# Altium schematic sheet B505_Clk_syn.SchDoc
size A3
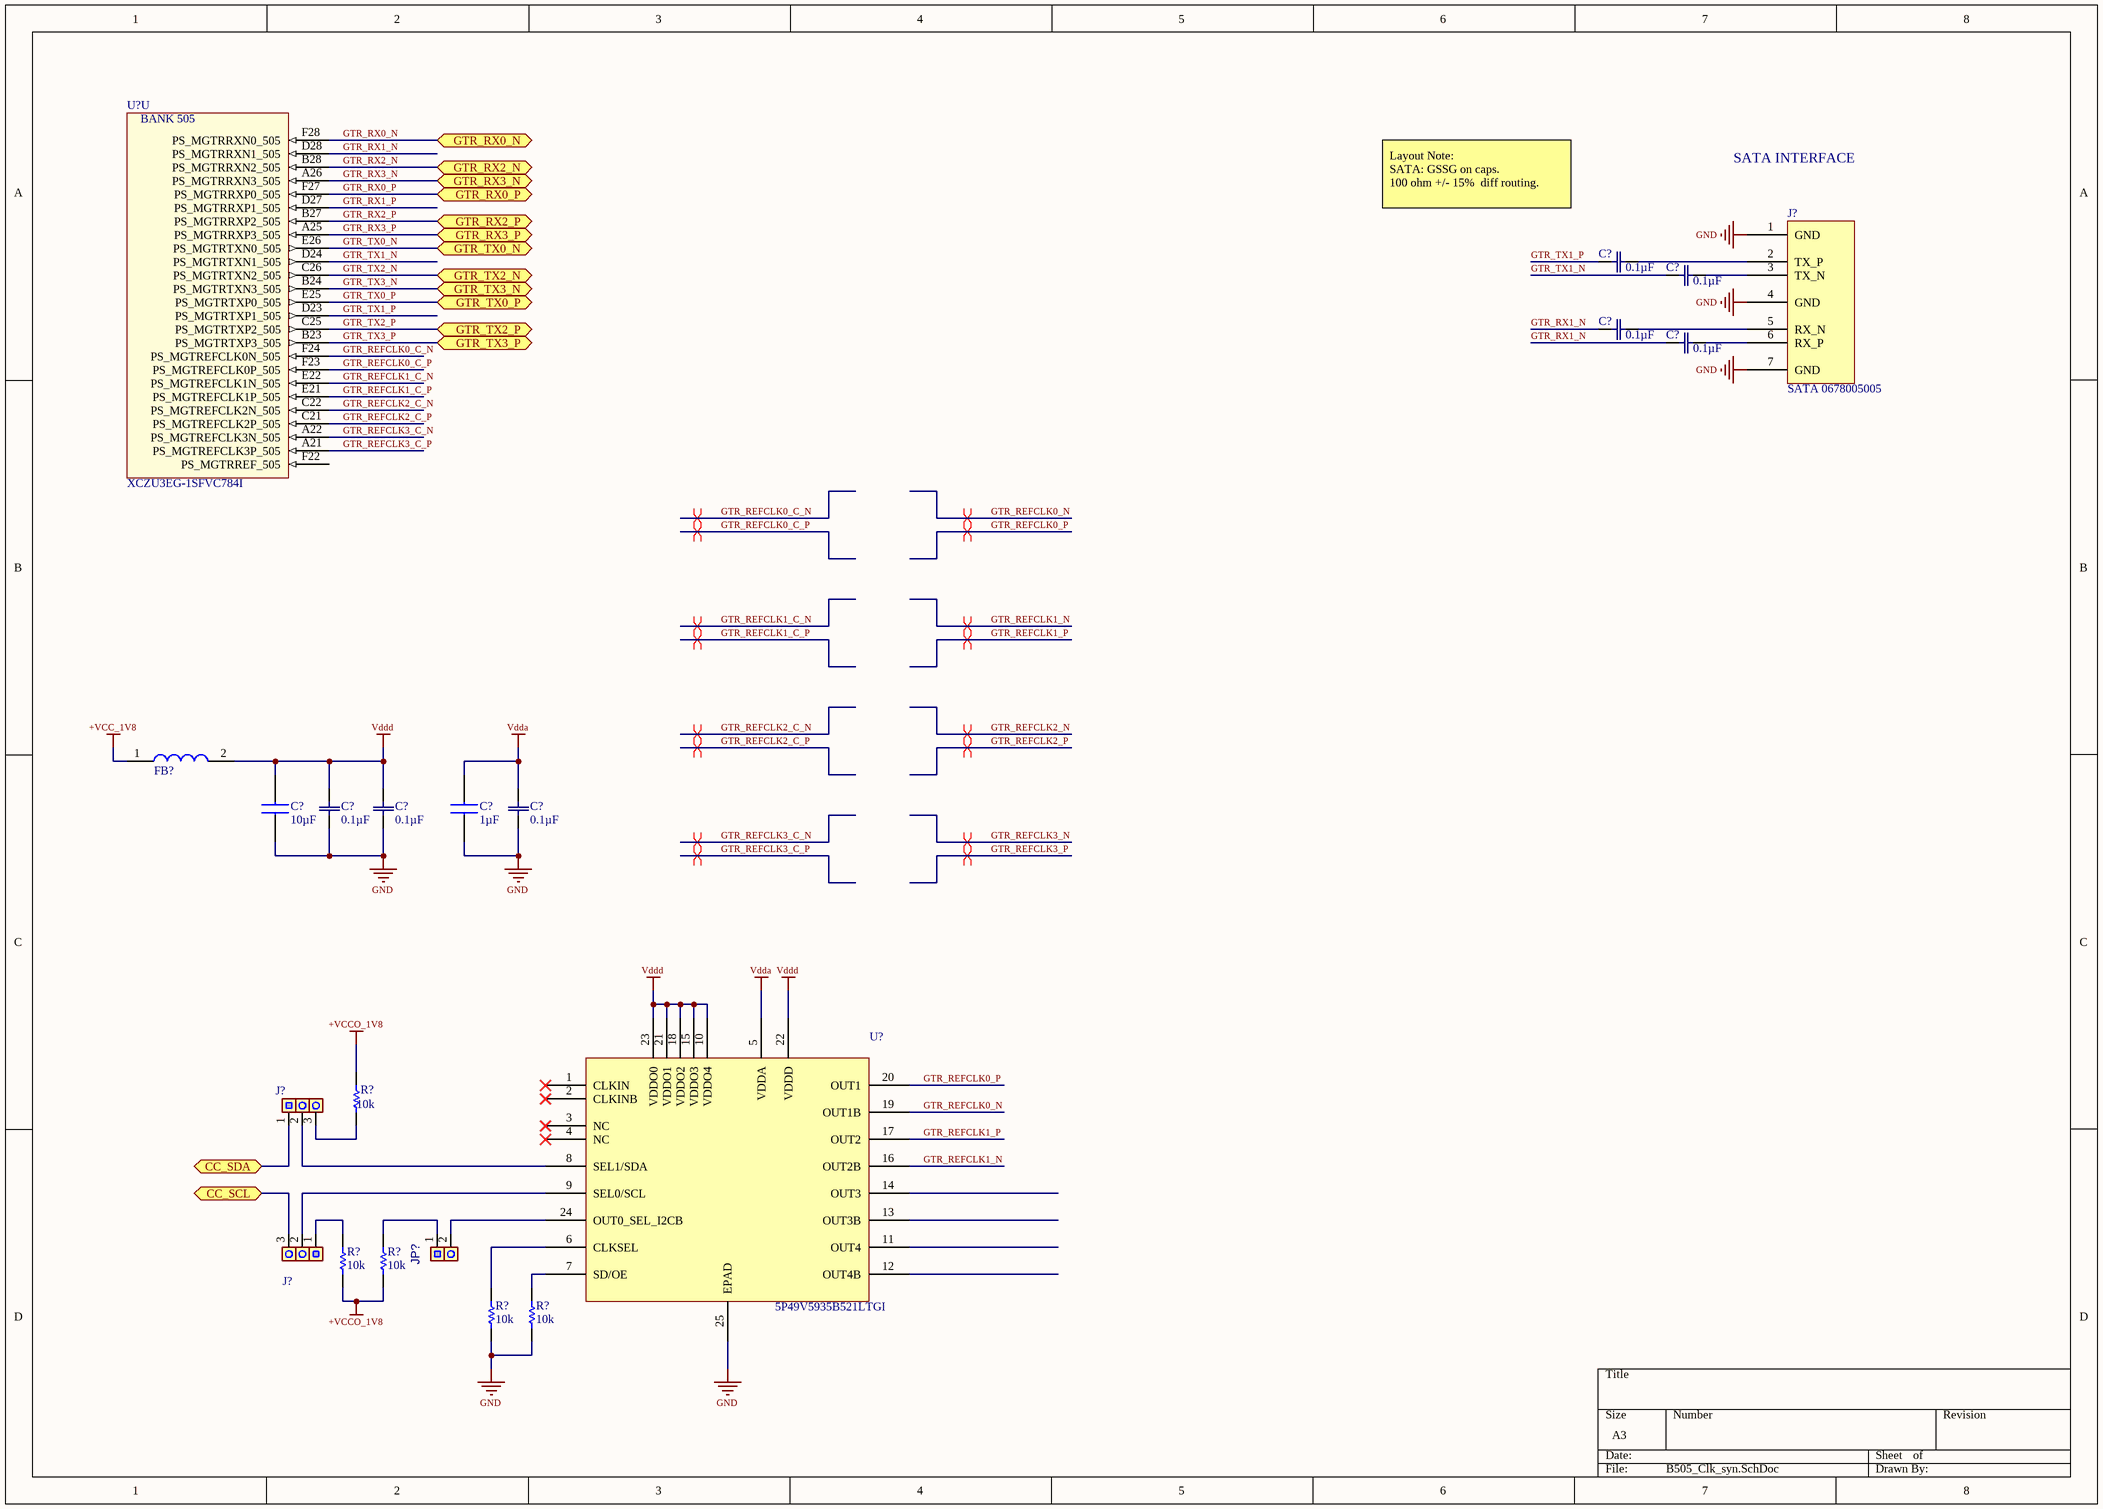
[diagram p0: B505_Clk_syn.SchDoc]

## Parts
(Parts that share a designator on the sheet are numbered #1, #2 ... from top to bottom, then left to right.)
C?#1  0.1µF  [CAP_0603]
C?#2  0.1µF  [CAP_0603]
C?#3  0.1µF  [CAP_0603]
C?#4  0.1µF  [CAP_0603]
C?#5  value 0.1µF  [CAP_0603]  (hidden comment: C0603X5R1E104K030BB)
C?#6  value 0.1µF  [CAP_0603]  (hidden comment: C0603X5R1E104K030BB)
C?#7  value 0.1µF  [CAP_0603]  (hidden comment: C0603X5R1E104K030BB)
C?#8  value 10µF  [CAP 0805]  (hidden comment: CAP 0805C106K4PACTU)
C?#9  value 1µF  [C0805C105]  (hidden comment: CAP 0805C105K5RACTU)
FB?  BLM15AG601SN1D  [BEADC1005X55N]  (value not drawn)
J?#1  SATA 0678005005  [SATA HEADER]
J?#2  5-146280-3  [CONN_5-146280-3]  (value not drawn)
J?#3  5-146280-3  [CONN_5-146280-3]  (value not drawn)
JP?  HDR-2.54 Male 1x2  [HDR_M_2.54_1x2]  (value not drawn)
R?#1  value 10k  [RESC1005L_0402]  (hidden comment: RES0402_10K_0W1_05T)
R?#2  value 10k  [RESC1005L_0402]  (hidden comment: RES0402_10K_0W1_05T)
R?#3  value 10k  [RESC1005L_0402]  (hidden comment: RES0402_10K_0W1_05T)
R?#4  value 10k  [RESC1005L_0402]  (hidden comment: RES0402_10K_0W1_05T)
R?#5  value 10k  [RESC1005L_0402]  (hidden comment: RES0402_10K_0W1_05T)
U?#1  XCZU3EG-1SFVC784I  [BGA784x28]  (part U of 22)
U?#2  5P49V5935B521LTGI

## Ports
CC_SCL, CC_SDA, GTR_RX0_N, GTR_RX0_P, GTR_RX2_N, GTR_RX2_P, GTR_RX3_N, GTR_RX3_P, GTR_TX0_N, GTR_TX0_P, GTR_TX2_N, GTR_TX2_P, GTR_TX3_N, GTR_TX3_P

## Nets
+VCC_1V8: FB?.1
+VCCO_1V8: R?#1.2 R?#2.1 R?#3.1
GND: C?#5.1 C?#6.1 C?#7.1 C?#8.1 C?#9.1 J?#1.1(GND) J?#1.4(GND) J?#1.7(GND) R?#4.1 R?#5.1 U?#2.25(EPAD)
Vdda: C?#7.2 C?#9.2 U?#2.5(VDDA)
Vddd: C?#5.2 C?#6.2 C?#8.2 FB?.2 U?#2.10(VDDO4) U?#2.15(VDDO3) U?#2.18(VDDO2) U?#2.21(VDDO1) U?#2.22(VDDD) U?#2.23(VDDO0)
CC_SCL: J?#3.3(P3) ; port CC_SCL
CC_SDA: J?#2.1(P1) ; port CC_SDA
GTR_REFCLK0_C_N: U?#1.F24(PS_MGTREFCLK0N_505)
GTR_REFCLK0_C_P: U?#1.F23(PS_MGTREFCLK0P_505)
GTR_REFCLK0_N: U?#2.19(OUT1B)
GTR_REFCLK0_P: U?#2.20(OUT1)
GTR_REFCLK1_C_N: U?#1.E22(PS_MGTREFCLK1N_505)
GTR_REFCLK1_C_P: U?#1.E21(PS_MGTREFCLK1P_505)
GTR_REFCLK1_N: U?#2.16(OUT2B)
GTR_REFCLK1_P: U?#2.17(OUT2)
GTR_REFCLK2_C_N: U?#1.C22(PS_MGTREFCLK2N_505)
GTR_REFCLK2_C_P: U?#1.C21(PS_MGTREFCLK2P_505)
GTR_REFCLK3_C_N: U?#1.A22(PS_MGTREFCLK3N_505)
GTR_REFCLK3_C_P: U?#1.A21(PS_MGTREFCLK3P_505)
GTR_RX0_N: U?#1.F28(PS_MGTRRXN0_505) ; port GTR_RX0_N
GTR_RX0_P: U?#1.F27(PS_MGTRRXP0_505) ; port GTR_RX0_P
GTR_RX1_N: C?#3.2 C?#4.2 U?#1.D28(PS_MGTRRXN1_505)
GTR_RX1_P: U?#1.D27(PS_MGTRRXP1_505)
GTR_RX2_N: U?#1.B28(PS_MGTRRXN2_505) ; port GTR_RX2_N
GTR_RX2_P: U?#1.B27(PS_MGTRRXP2_505) ; port GTR_RX2_P
GTR_RX3_N: U?#1.A26(PS_MGTRRXN3_505) ; port GTR_RX3_N
GTR_RX3_P: U?#1.A25(PS_MGTRRXP3_505) ; port GTR_RX3_P
GTR_TX0_N: U?#1.E26(PS_MGTRTXN0_505) ; port GTR_TX0_N
GTR_TX0_P: U?#1.E25(PS_MGTRTXP0_505) ; port GTR_TX0_P
GTR_TX1_N: C?#2.2 U?#1.D24(PS_MGTRTXN1_505)
GTR_TX1_P: C?#1.2 U?#1.D23(PS_MGTRTXP1_505)
GTR_TX2_N: U?#1.C26(PS_MGTRTXN2_505) ; port GTR_TX2_N
GTR_TX2_P: U?#1.C25(PS_MGTRTXP2_505) ; port GTR_TX2_P
GTR_TX3_N: U?#1.B24(PS_MGTRTXN3_505) ; port GTR_TX3_N
GTR_TX3_P: U?#1.B23(PS_MGTRTXP3_505) ; port GTR_TX3_P
NetC?#1_1: C?#1.1 J?#1.2(TX_P)
NetC?#2_1: C?#2.1 J?#1.3(TX_N)
NetC?#3_1: C?#3.1 J?#1.5(RX_N)
NetC?#4_1: C?#4.1 J?#1.6(RX_P)
NetJ?#2_2: J?#2.2(P2) U?#2.8(SEL1/SDA)
NetJ?#2_3: J?#2.3(P3) R?#1.1
NetJ?#3_1: J?#3.1(P1) R?#2.2
NetJ?#3_2: J?#3.2(P2) U?#2.9(SEL0/SCL)
NetJP?_1: JP?.1(P1) R?#3.2
NetJP?_2: JP?.2(P2) U?#2.24(OUT0_SEL_I2CB)
NetR?#4_2: R?#4.2 U?#2.6(CLKSEL)
NetR?#5_2: R?#5.2 U?#2.7(SD/OE)

Not connected (* = marked no-connect by the designer): U?#1 F22(PS_MGTRREF_505); U?#2 1(CLKIN)* 2(CLKINB)* 3(NC)* 4(NC)* 11(OUT4) 12(OUT4B) 13(OUT3B) 14(OUT3)

## Layout directives
differential pair: GTR_REFCLK0_C_N, GTR_REFCLK0_C_P, GTR_REFCLK0_N, GTR_REFCLK0_P, GTR_REFCLK1_C_N, GTR_REFCLK1_C_P, GTR_REFCLK1_N, GTR_REFCLK1_P, GTR_REFCLK2_C_N, GTR_REFCLK2_C_P, GTR_REFCLK2_N, GTR_REFCLK2_P, GTR_REFCLK3_C_N, GTR_REFCLK3_C_P, GTR_REFCLK3_N, GTR_REFCLK3_P

## Notes on the sheet
- SATA INTERFACE
- Layout Note:
  SATA: GSSG on caps.
  100 ohm +/- 15%  diff routing.
- (in symbol XCZU3EG-1SFVC784I, part U) BANK 505

## Library data of the parts
C?#1-C?#4 = CAP 0603X5R1E104K030BB: CAP CER 0.1UF 25V 10% X5R 0201; Manufacturer Part Number: C0603X5R1E104K030BB; Manufacturer: TDK Corporation; Detailed Description: 0.1µF ±10% 25V Ceramic Capacitor X5R 0201 (0603 Metric); Digi-Key Part Number: 445-13671-1-ND; Tolerance: ±10%; Voltage - Rated: 25V; Temperature Coefficient: X5R; Operating Temperature: -55°C ~ 85°C; Features: Low ESL; Applications: General Purpose; Mounting Type: Surface Mount, MLCC; Supplier 1: Digi-Key; Supplier Part Number 1: 445-13671-1-ND; Value: 0.1µF
C?#5-C?#7 = CAP 0603X5R1E104K030BB: CAP CER 0.1UF 25V 10% X5R 0201; Manufacturer: TDK Corporation; Detailed Description: 0.1µF ±10% 25V Ceramic Capacitor X5R 0201 (0603 Metric); Manufacturer Part Number: C0603X5R1E104K030BB; Digi-Key Part Number: 445-13671-1-ND; Tolerance: ±10%; Voltage - Rated: 25V; Temperature Coefficient: X5R; Operating Temperature: -55°C ~ 85°C; Features: Low ESL; Applications: General Purpose; Mounting Type: Surface Mount, MLCC; Supplier 1: Digi-Key; Supplier Part Number 1: 445-13671-1-ND
C?#8 = CAP 0805C106K4PACTU: Capacitor 0805 10uF 16V Kemet 0805 C 10F Ceramic Multilayer Capacitor, 16 V dc, +85C, X5R Dielectric, 10%; Manufacturer Part Number: C0805C106K4PACTU; Geometry.Height: 0.88mm; Detailed Description: 10µF ±10% 16V Ceramic Capacitor X5R 0805 (2012 Metric); Supplier_Name: RS; RS Part Number: 6911161; Manufacturer: Kemet; Allied_Number: *; Other Part Number: *; Datasheet Link: http://docs-europe.electrocomponents.com/webdocs/116e/0900766b8116eb59.pdf; 3D Package: *; Digi-Key Part Number: 399-8012-1-ND; Tolerance: ±10%; Voltage - Rated: 16V; Temperature Coefficient: X5R; Operating Temperature: -55°C ~ 85°C; Features: Low ESL; Applications: General Purpose; Mounting Type: Surface Mount, MLCC; Supplier 1: Digi-Key; Supplier Part Number 1: 399-8012-1-ND
C?#9 = CAP 0805C105K5RACTU: Capacitor 0805 10uF 16V Kemet 0805 C 10F Ceramic Multilayer Capacitor, 16 V dc, +85C, X5R Dielectric, 10%; Manufacturer Part Number: C0805C105K5RACTU; Geometry.Height: 0.88mm; Detailed Description: 10µF ±10% 16V Ceramic Capacitor X5R 0805 (2012 Metric); Voltage - Rated: 50V; Temperature Coefficient: X7R; Supplier_Name: RS; Manufacturer: Kemet; Allied_Number: *; Other Part Number: *; Datasheet Link: http://docs-europe.electrocomponents.com/webdocs/116e/0900766b8116eb59.pdf; 3D Package: *; Digi-Key Part Number: 399-7409-1-ND; Tolerance: ±10%; Operating Temperature: -55°C ~ 125°C; Features: Low ESL; Applications: General Purpose; Mounting Type: Surface Mount, MLCC; Supplier 1: Digi-Key; Supplier Part Number 1: 399-7409-1-ND
FB? = F BLM15AG601SN1D: Ferrite bead SMD 0402 600R 300mA; Manufacturer_Name: Murata Electronics; Geometry.Height: 0.55mm; Number of Lines: 1; Impedance @ Frequency: 600 Ohm @ 100MHz; DC Resistance (DCR) (Max): 520 mOhm; Manufacturer_Part_Number: BLM15AG601SN1D; Datasheet Link: http://www.murata.com/~/media/webrenewal/support/library/catalog/products/emc/emifil/c31e.ashx?la=en-gb; Digi-Key Part Number: 490-1006-1-ND; Series: EMIFIL®, BLM15; Current Rating (Max): 300mA; Operating Temperature: -55°C ~ 125°C; Package / Case: 0402 (1005 Metric); Mounting Type: Surface Mount; Height (Max): 0.022" (0.55mm); Size / Dimension: 0.039" L x 0.020" W (1.00mm x 0.50mm); Supplier 1: Digi-Key; Supplier Part Number 1: 490-1006-1-ND
J?#1 = SATA 0678005005: CONN HEADER 7POS VERT SMD 15GOLD; Manufacturer: Molex, LLC; Connector Style: Header, Shrouded; Number of Positions: 7; Digi-Key Part Number: WM19104-ND; Manufacturer Part Number: 0678005005; Series: 67800; Part Status: Active; Connector Type: SATA; Mounting Type: Surface Mount; Termination: Solder; Features: Board Guide; Contact Finish: Gold; Contact Finish Thickness: 15µin (0.38µm); Supplier 1: Digi-Key; Supplier Part Number 1: WM19104-ND
J?#2 J?#3 = Header 1x3: CONN HEADR BRKWAY .100 3POS STR; Manufacturer: TE Connectivity; Manufacturer Part Number: 5-146280-3
JP? = Header 1x2: CONN HEADER 2POS .100" SGL GOLD; Manufacturer Part Number 1: TSW-102-07-G-S; Manufacturer 1: Samtec; Part Checked: Jennifer Hancock; Description_: CON HDR-2.54 MALE 1x2 GOLD 5.84MH TH VERT; Populated: Yes; Package: Through Hole; Supplier 1: Digi-Key; Supplier Part Number 1: SAM1029-02-ND; Value: HDR-2.54 Male 1x2; Part Footprint Checked: *; Part Golden: Jennifer Hancock; Part 3D Model Checked: Jennifer Hancock; Manufacturer 2: FCI; Manufacturer Part Number 2: 68000-236HLF; Revision Date: 08/14/2015; Tolerance: *; Rating: *; Owner: *; Document Link: //depot_np_hweng_boards/altium_libraries/datasheets/Samtec/TSW_TH.pdf
R?#1-R?#5 = RES0402_10K_0W1_05T: RES SMD 10K OHM 0.5% 1/16W 0402; Manufacturer: Panasonic Electronic Components; Manufacturer Part Number: ERJ-2RHD1002X; Package: 0402; ComponentLink1Description: Datasheet; Power: 1/16W; Tolerance: 0.5%; Supplier 1: Digi-Key; Supplier Part Number 1: P15984CT-ND
U?#1 = XCZU3EG-1SFVC784I: IC FPGA 252 I/O 784FCBGA - XILINX ZYNQ ULTRASCALE+; Manufacturer 1: Xilinx Inc.; Package: SFVC784; ComponentLink1Description: Datasheet; Supplier 1: Digi-Key; Supplier Part Number 1: XCZU3EG-1SFVC784I-ND; Manufacturer Part Number 1: XCZU3EG-1SFVC784I
U?#2 = 5P49V5935B521LTGI: CLOCK GENERATOR 1MHZ TO 350MHZ 24-VFQFPN; Manufacturer: IDT (Integrated Device Technology); Series: 5P49V5935B; Type: Programmable Clock Generators; Max Output Freq: 350 MHz; Package/Case: VFQFPN-24; Supplier 1: Mouser; Supplier Part Number 1: Anonymous Daily Limit Reached; Manufacturer Part Number: 5P49V5935B521LTGI; Maximum Input Frequency:: 350 MHz